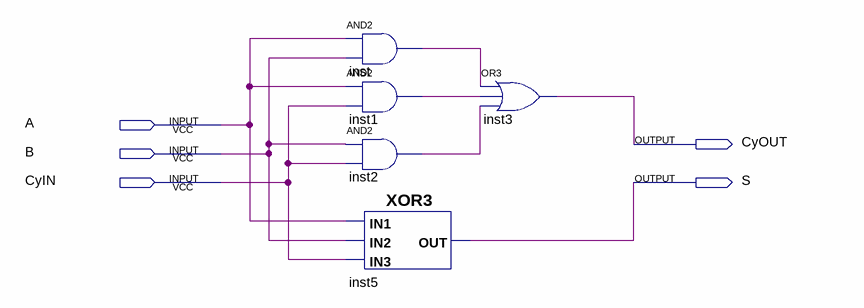
[diagram p0: schematic sheet]
// Quartus schematic sumadorCompleto.bdf as structural Verilog: 5 symbols, 5 pins
module sumadorCompleto (
  input  A,
  input  B,
  input  CyIN,
  output CyOUT,
  output S
);

  wire inst1_out, inst2_out, inst_out;

  and inst (inst_out, A, B);
  and inst1 (inst1_out, A, CyIN);
  and inst2 (inst2_out, B, CyIN);
  XOR3 inst5 (.IN3(CyIN), .IN1(A), .IN2(B), .OUT(S));
  or inst3 (CyOUT, inst_out, inst1_out, inst2_out);
endmodule
